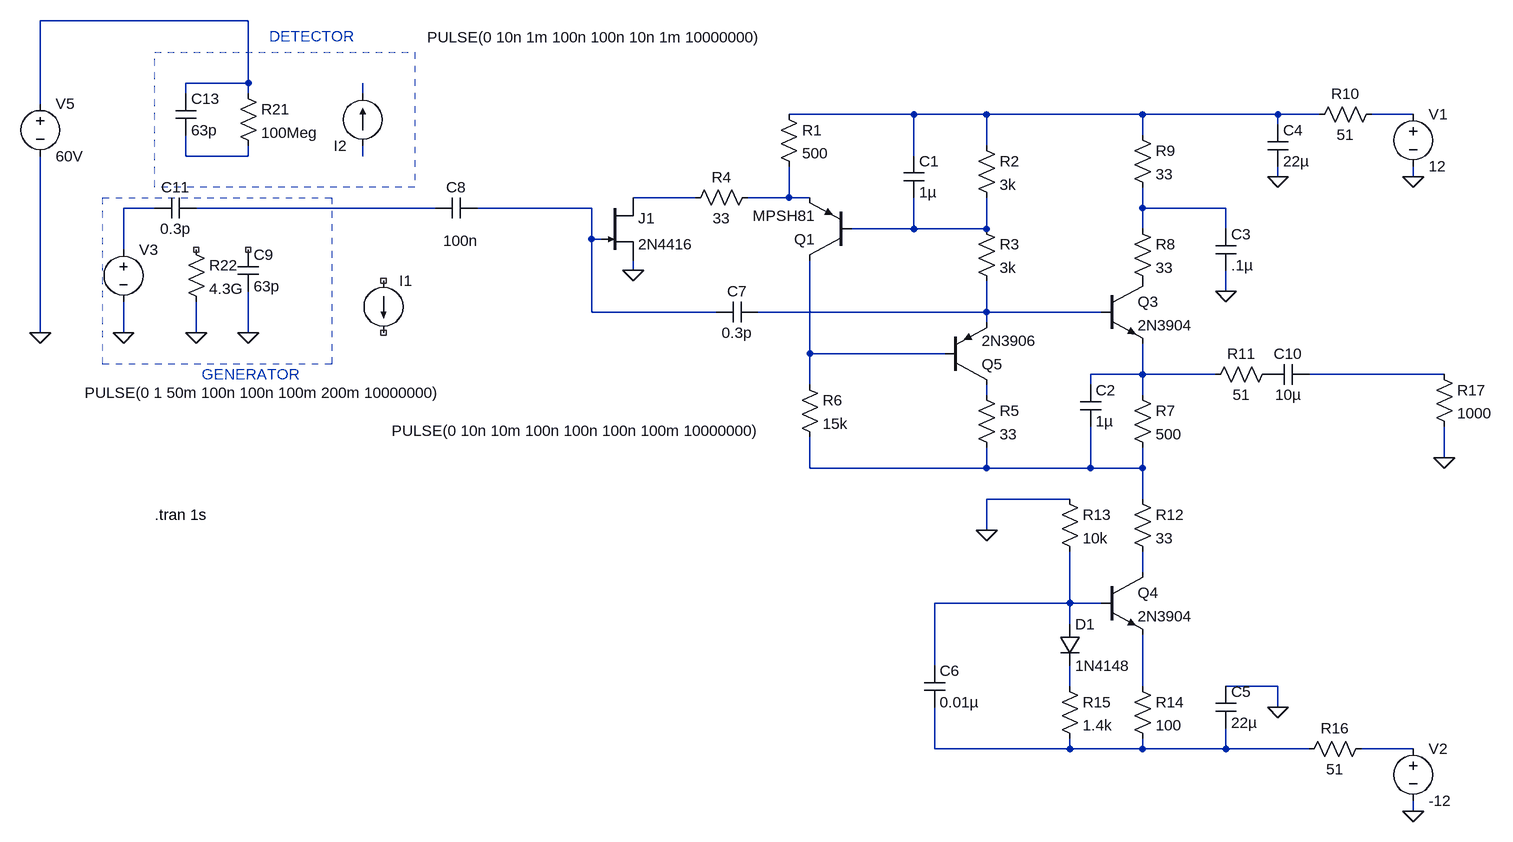
[diagram p0: schematic CSP_AC_coupling.asc]
CSP_AC_coupling.asc, the LTspice schematic file:
Version 4
SHEET 1 964 824
WIRE -960 -432 -1280 -432
WIRE -960 -336 -960 -432
WIRE -960 -336 -1056 -336
WIRE -1056 -320 -1056 -336
WIRE -960 -320 -960 -336
WIRE -784 -320 -784 -336
WIRE -1280 -304 -1280 -432
WIRE 64 -288 -128 -288
WIRE 176 -288 64 -288
WIRE 416 -288 176 -288
WIRE 624 -288 416 -288
WIRE 688 -288 624 -288
WIRE 832 -288 768 -288
WIRE 624 -272 624 -288
WIRE 416 -256 416 -288
WIRE 176 -240 176 -288
WIRE -1056 -224 -1056 -256
WIRE -960 -224 -960 -240
WIRE -960 -224 -1056 -224
WIRE -784 -224 -784 -240
WIRE 64 -224 64 -288
WIRE 624 -192 624 -208
WIRE 832 -192 832 -208
WIRE -272 -160 -368 -160
WIRE -128 -160 -128 -208
WIRE -128 -160 -192 -160
WIRE -96 -160 -128 -160
WIRE -1104 -144 -1152 -144
WIRE -672 -144 -1040 -144
WIRE -432 -144 -608 -144
WIRE 416 -144 416 -176
WIRE 544 -144 416 -144
WIRE 64 -112 64 -160
WIRE 64 -112 -32 -112
WIRE 176 -112 176 -160
WIRE 176 -112 64 -112
WIRE 416 -112 416 -144
WIRE 544 -112 544 -144
WIRE -432 -96 -432 -144
WIRE -416 -96 -432 -96
WIRE -1152 -80 -1152 -144
WIRE -368 -48 -368 -64
WIRE 544 -16 544 -48
WIRE -432 16 -432 -96
WIRE -240 16 -432 16
WIRE 176 16 176 -32
WIRE 176 16 -176 16
WIRE 352 16 176 16
WIRE 176 32 176 16
WIRE -1280 48 -1280 -224
WIRE -1152 48 -1152 0
WIRE -1040 48 -1040 0
WIRE -960 48 -960 -16
WIRE -96 80 -96 -64
WIRE 112 80 -96 80
WIRE 416 112 416 64
WIRE 416 112 336 112
WIRE 528 112 416 112
WIRE 880 112 672 112
WIRE -96 128 -96 80
WIRE 336 128 336 112
WIRE 176 144 176 128
WIRE 416 144 416 112
WIRE 880 240 880 192
WIRE -96 256 -96 208
WIRE 176 256 176 224
WIRE 176 256 -96 256
WIRE 336 256 336 192
WIRE 336 256 176 256
WIRE 416 256 416 224
WIRE 416 256 336 256
WIRE 304 304 176 304
WIRE 416 304 416 256
WIRE 176 352 176 304
WIRE 416 416 416 384
WIRE 304 464 304 384
WIRE 304 464 96 464
WIRE 352 464 304 464
WIRE 304 496 304 464
WIRE 96 560 96 464
WIRE 304 592 304 560
WIRE 416 592 416 512
WIRE 624 592 544 592
WIRE 624 624 624 592
WIRE 96 688 96 624
WIRE 304 688 304 672
WIRE 304 688 96 688
WIRE 416 688 416 672
WIRE 416 688 304 688
WIRE 544 688 544 656
WIRE 544 688 416 688
WIRE 672 688 544 688
WIRE 832 688 752 688
WIRE 832 784 832 768
FLAG 544 -16 0
FLAG 624 -192 0
FLAG 176 352 0
FLAG 624 624 0
FLAG 832 784 0
FLAG 832 -192 0
FLAG 880 240 0
FLAG -368 -48 0
FLAG -1280 48 0
FLAG -1152 48 0
FLAG -1040 48 0
FLAG -960 48 0
DATAFLAG -448 -144 ""
DATAFLAG 720 112 ""
DATAFLAG 416 112 ""
DATAFLAG 640 -288 ""
DATAFLAG 608 688 ""
DATAFLAG 784 688 ""
DATAFLAG 800 -288 ""
DATAFLAG -160 -160 ""
DATAFLAG 32 -112 ""
DATAFLAG -96 -16 ""
DATAFLAG 144 16 ""
DATAFLAG 64 80 ""
DATAFLAG 448 -144 ""
DATAFLAG -336 -160 ""
SYMBOL res -144 -304 R0
SYMATTR InstName R1
SYMATTR Value 500
SYMBOL cap 48 -224 R0
SYMATTR InstName C1
SYMATTR Value 1µ
SYMBOL res 160 -256 R0
SYMATTR InstName R2
SYMATTR Value 3k
SYMBOL pnp -32 -64 R180
SYMATTR InstName Q1
SYMATTR Value MPSH81
SYMBOL res 160 -128 R0
SYMATTR InstName R3
SYMATTR Value 3k
SYMBOL res -176 -176 R90
WINDOW 0 0 56 VBottom 2
WINDOW 3 32 56 VTop 2
SYMATTR InstName R4
SYMATTR Value 33
SYMBOL res 160 128 R0
SYMATTR InstName R5
SYMATTR Value 33
SYMBOL res -112 112 R0
SYMATTR InstName R6
SYMATTR Value 15k
SYMBOL npn 352 -32 R0
SYMATTR InstName Q3
SYMATTR Value 2N3904
SYMBOL cap 320 128 R0
SYMATTR InstName C2
SYMATTR Value 1µ
SYMBOL res 400 128 R0
SYMATTR InstName R7
SYMATTR Value 500
SYMBOL res 400 -128 R0
SYMATTR InstName R8
SYMATTR Value 33
SYMBOL res 400 -272 R0
SYMATTR InstName R9
SYMATTR Value 33
SYMBOL cap 528 -112 R0
SYMATTR InstName C3
SYMATTR Value .1µ
SYMBOL cap 608 -272 R0
SYMATTR InstName C4
SYMATTR Value 22µ
SYMBOL res 784 -304 R90
WINDOW 0 0 56 VBottom 2
WINDOW 3 32 56 VTop 2
SYMATTR InstName R10
SYMATTR Value 51
SYMBOL res 624 96 R90
WINDOW 0 0 56 VBottom 2
WINDOW 3 32 56 VTop 2
SYMATTR InstName R11
SYMATTR Value 51
SYMBOL res 400 288 R0
SYMATTR InstName R12
SYMATTR Value 33
SYMBOL res 288 288 R0
SYMATTR InstName R13
SYMATTR Value 10k
SYMBOL npn 352 416 R0
SYMATTR InstName Q4
SYMATTR Value 2N3904
SYMBOL res 400 576 R0
SYMATTR InstName R14
SYMATTR Value 100
SYMBOL cap 528 592 R0
SYMATTR InstName C5
SYMATTR Value 22µ
SYMBOL diode 288 496 R0
SYMATTR InstName D1
SYMATTR Value 1N4148
SYMBOL res 288 576 R0
SYMATTR InstName R15
SYMATTR Value 1.4k
SYMBOL cap 80 560 R0
SYMATTR InstName C6
SYMATTR Value 0.01µ
SYMBOL res 768 672 R90
WINDOW 0 0 56 VBottom 2
WINDOW 3 32 56 VTop 2
SYMATTR InstName R16
SYMATTR Value 51
SYMBOL njf -416 -160 R0
SYMATTR InstName J1
SYMATTR Value 2N4416
SYMBOL voltage 832 -304 R0
WINDOW 123 0 0 Left 0
WINDOW 39 0 0 Left 0
SYMATTR InstName V1
SYMATTR Value 12
SYMBOL voltage 832 672 R0
WINDOW 123 0 0 Left 0
WINDOW 39 0 0 Left 0
SYMATTR InstName V2
SYMATTR Value -12
SYMBOL res 864 96 R0
SYMATTR InstName R17
SYMATTR Value 1000
SYMBOL cap -176 0 R90
WINDOW 0 0 32 VBottom 2
WINDOW 3 32 32 VTop 2
SYMATTR InstName C7
SYMATTR Value 0.3p
SYMBOL pnp 112 128 M180
SYMATTR InstName Q5
SYMATTR Value 2N3906
SYMBOL cap -608 -160 R90
WINDOW 0 0 32 VBottom 2
WINDOW 3 51 25 VTop 2
SYMATTR InstName C8
SYMATTR Value 100n
SYMBOL cap 672 96 R90
WINDOW 0 0 32 VBottom 2
WINDOW 3 32 32 VTop 2
SYMATTR InstName C10
SYMATTR Value 10µ
SYMBOL voltage -1280 -320 R0
WINDOW 123 0 0 Left 0
WINDOW 39 0 0 Left 0
SYMATTR InstName V5
SYMATTR Value 60V
SYMBOL res -976 -336 R0
SYMATTR InstName R21
SYMATTR Value 100Meg
SYMBOL res -1056 -96 R0
SYMATTR InstName R22
SYMATTR Value 4.3G
SYMBOL cap -1072 -320 R0
SYMATTR InstName C13
SYMATTR Value 63p
SYMBOL current -752 -32 R0
WINDOW 3 13 231 Left 2
WINDOW 123 0 0 Left 0
WINDOW 39 0 0 Left 0
SYMATTR Value PULSE(0 10n 10m 100n 100n 100n 100m 10000000)
SYMATTR InstName I1
SYMBOL current -784 -240 R180
WINDOW 3 -619 167 Left 2
WINDOW 123 0 0 Left 0
WINDOW 39 0 0 Left 0
SYMATTR Value PULSE(0 10n 1m 100n 100n 10n 1m 10000000)
SYMATTR InstName I2
SYMBOL cap -976 -80 R0
SYMATTR InstName C9
SYMATTR Value 63p
SYMBOL voltage -1152 -96 R0
WINDOW 123 0 0 Left 0
WINDOW 39 0 0 Left 0
WINDOW 3 -60 236 Left 2
SYMATTR InstName V3
SYMATTR Value PULSE(0 1 50m 100n 100n 100m 200m 10000000)
SYMBOL cap -1040 -160 R90
WINDOW 0 0 32 VBottom 2
WINDOW 3 32 32 VTop 2
SYMATTR InstName C11
SYMATTR Value 0.3p
TEXT -1104 328 Left 2 !.tran 1s
TEXT -928 -408 Left 2 ;DETECTOR
TEXT -1032 112 Left 2 ;GENERATOR
RECTANGLE Normal -704 -176 -1104 -384 2
RECTANGLE Normal -832 96 -1184 -160 2

The netlist it stands for:
* CSP_AC_coupling.asc
R1 N003 N008 500
C1 N003 N013 1µ
R2 N003 N013 3k
Q1 N015 N013 N008 0 MPSH81
R3 N013 N014 3k
R4 N008 N007 33
R5 N018 N019 33
R6 N015 N019 15k
Q3 P001 N014 N016 0 2N3904
C2 N016 N019 1µ
R7 N016 N019 500
R8 N012 P001 33
R9 N003 N012 33
C3 N012 0 .1µ
C4 N003 0 22µ
R10 N004 N003 51
R11 P002 N016 51
R12 N019 N020 33
R13 0 N021 10k
Q4 N020 N021 N023 0 2N3904
R14 N023 N024 100
C5 0 N024 22µ
D1 N021 N022 1N4148
R15 N022 N024 1.4k
C6 N021 N024 0.01µ
R16 N025 N024 51
J1 N007 N011 0 2N4416
V1 N004 0 12
V2 N025 0 -12
R17 N017 0 1000
C7 N014 N011 0.3p
Q5 N018 N015 N014 0 2N3906
C8 N011 N010 100n
C10 N017 P002 10µ
V5 N001 0 60V
R21 N001 N005 100Meg
R22 NC_01 0 4.3G
C13 N001 N005 63p
I1 NC_02 NC_03 PULSE(0 10n 10m 100n 100n 100n 100m 10000000)
I2 N006 N002 PULSE(0 10n 1m 100n 100n 10n 1m 10000000)
C9 NC_04 0 63p
V3 N009 0 PULSE(0 1 50m 100n 100n 100m 200m 10000000)
C11 N010 N009 0.3p
.model D D
.lib standard.dio
.model NPN NPN
.model PNP PNP
.lib standard.bjt
.model NJF NJF
.model PJF PJF
.lib standard.jft
.tran 1s
* DETECTOR
* GENERATOR
.backanno
.end